# Altium schematic sheet WC_VGA.SchDoc
size A; Organization: Altium Limited; Address1: L3, 12a Rodborough Rd; Address2: Frenchs Forest; Address3: NSW; Address4: Australia 2086; DocumentNumber: 6; SheetNumber: 6; SheetTotal: 11
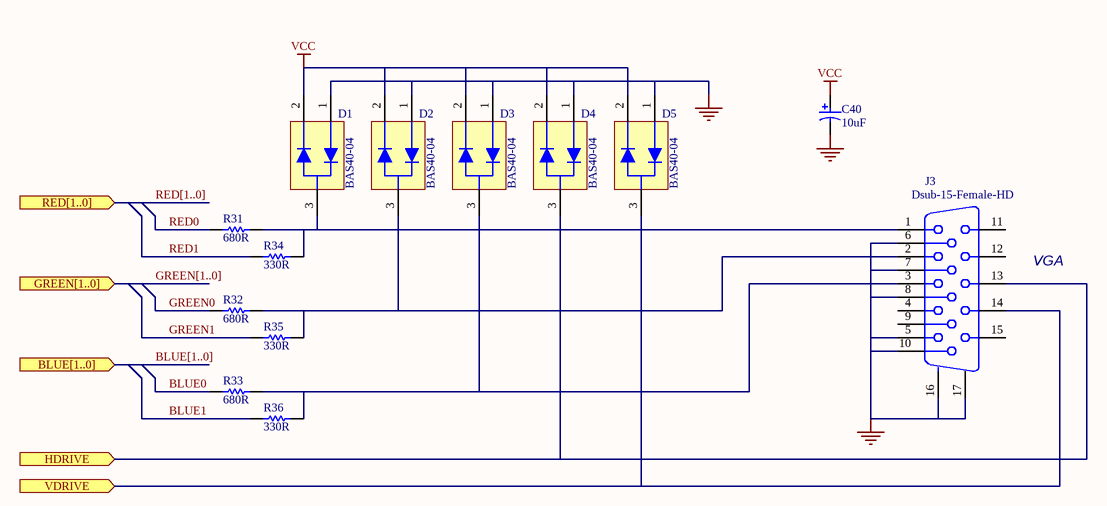
[diagram p0: WC_VGA.SchDoc]

## Parts
C40  10uF  [MCCT-B]
D1  BAS40-04  [SO-G3]
D2  BAS40-04  [SO-G3]
D3  BAS40-04  [SO-G3]
D4  BAS40-04  [SO-G3]
D5  BAS40-04  [SO-G3]
J3  Dsub-15-Female-HD  [DB15-VGA-Female]
R31  680R  [CC2012-0805]
R32  680R  [CC2012-0805]
R33  680R  [CC2012-0805]
R34  330R  [CC2012-0805]
R35  330R  [CC2012-0805]
R36  330R  [CC2012-0805]

## Ports
BLUE[1..0] (in), GREEN[1..0] (in), HDRIVE (in), RED[1..0] (in), VDRIVE (in)

## Nets
GND: C40.2 D1.1 D2.1 D3.1 D4.1 D5.1 J3.5 J3.6 J3.7 J3.8 J3.10 J3.16(MH1) J3.17(MH2)
VCC: C40.1 D1.2 D2.2 D3.2 D4.2 D5.2
BLUE0: R33.1
BLUE1: R36.1
GREEN0: R32.1
GREEN1: R35.1
HDRIVE: D4.3 J3.13 ; port HDRIVE
RED0: R31.1
RED1: R34.1
VDRIVE: D5.3 J3.14 ; port VDRIVE
NetD1_3: D1.3 J3.1 R31.2 R34.2
NetD2_3: D2.3 J3.2 R32.2 R35.2
NetD3_3: D3.3 J3.3 R33.2 R36.2

Not connected (* = marked no-connect by the designer): J3 4 9 11 12 15

## Buses and harness runs
bus BLUE[1..0] = port BLUE[1..0]
bus GREEN[1..0] = port GREEN[1..0]
bus RED[1..0] = port RED[1..0]

## Notes on the sheet
- VGA
- Title
- Size:
- Date:
- A
- Number:
- Time:
- Revision:
- Sheet
- of
- File:

## Library data of the parts
C40 = CAP_POLAR: Polar Capacitor; Supplier: FARNELL; Supplier Code: 967-117
D1-D5 = BAS40-04: Shottky Diode Pair
J3 = Dsub-15-Female-HD: Dsub-15 High density VGA Female connetor; Manufacturer: Generic Components; Package Information: Latest Revision: E; Class I: Connector; Positions: 30; Gender: Receptacle Header; Published: 15-Jun-2001; Revision: July-2002: Re-released for DXP Platform.; Datasheet: (31-Oct-1991); Package Reference: 174213; Publisher: Altium Limited; Orientation: Right Angle
R31-R36 = RES: Resistor